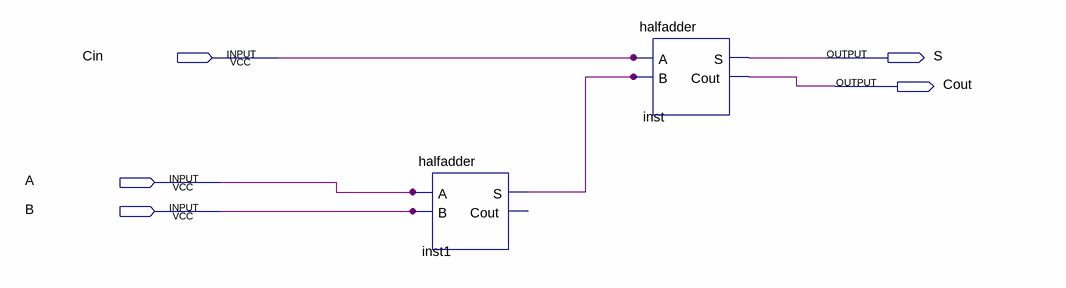
[diagram p0: schematic sheet]
// Quartus schematic fulladder.bdf as structural Verilog: 2 symbols, 5 pins
module fulladder (
  input  Cin,
  input  A,
  input  B,
  output S,
  output Cout
);

  wire inst1_s;

  halfadder inst1 (.A(A), .B(B), .S(inst1_s));  // open: Cout
  halfadder inst (.A(Cin), .B(inst1_s), .S(S), .Cout(Cout));
endmodule
